# EAGLE schematic ukmarsbot (EAGLE 7.6.0)
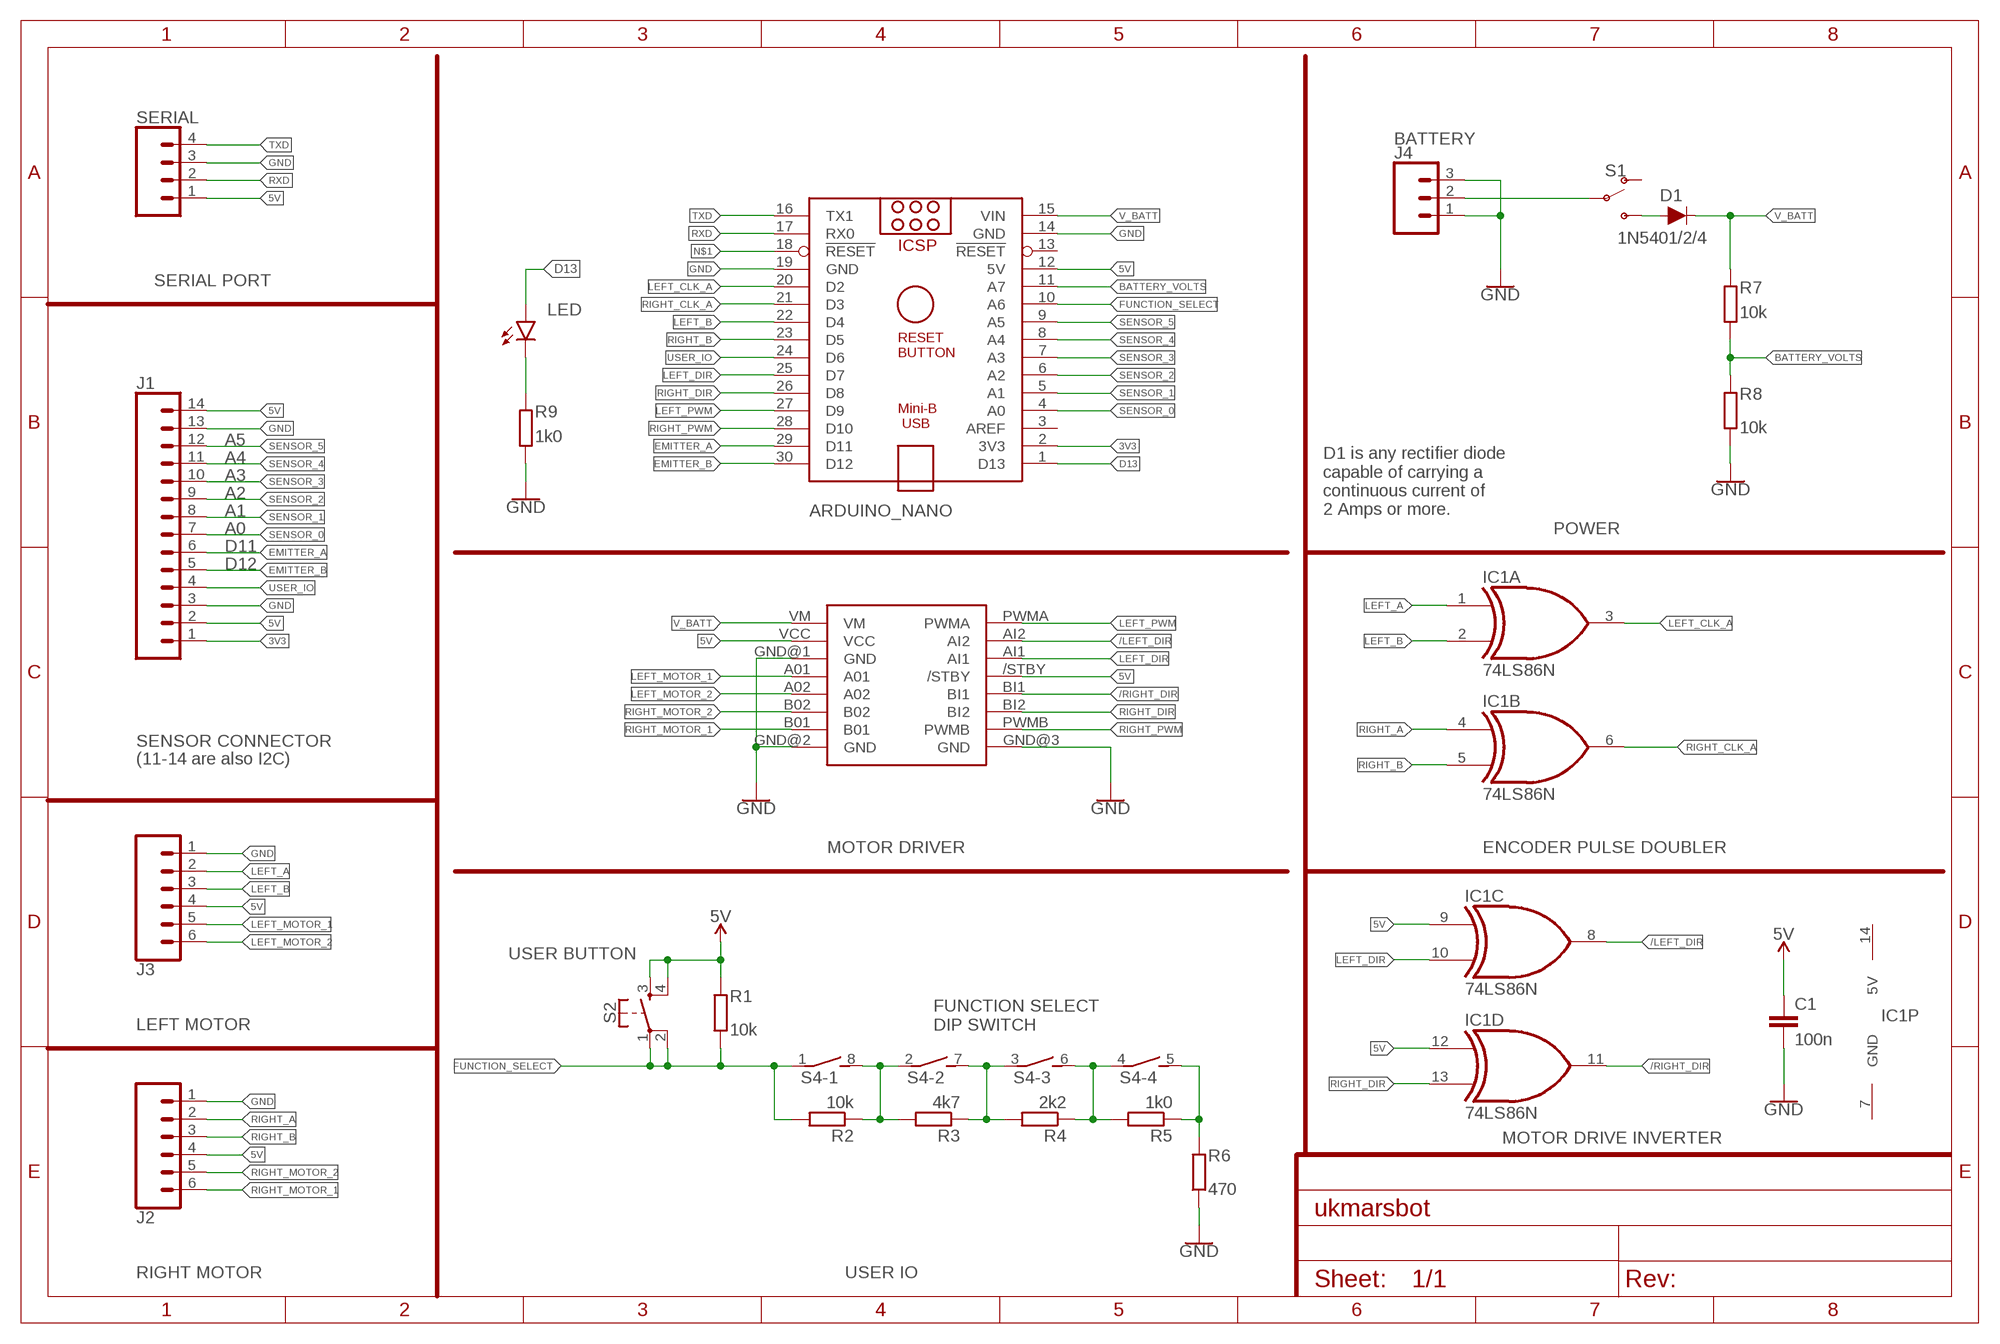
[diagram p0: schematic, sheet 1]
FFEWF (FRAME-A4L): DESIGNER: Peter Harrison; REV: V1.0

## Parts
ARDUINO_NANO  ARDUINO_NANO  [ARDUINO_NANO]
C1  100n  C-EU025-025X050  [C025-025X050]
D1  1N5401/2/4  DIODE-KIT2  [DIODE-1N4001-KIT]
IC1  74LS86N  [DIL14]
J1  CONN_14  [1X14]
J2  CONN_06SILK_FEMALE_PTH  [1X06]
J3  CONN_06SILK_FEMALE_PTH  [1X06]
J4  CONN_03  [1X03]
LED  LED3MM  [LED_3MM]
R1  10k  R-EU_0204/7  [0204/7]
R2  10k  R-EU_0204/7  [0204/7]
R3  4k7  R-EU_0204/7  [0204/7]
R4  2k2  R-EU_0204/7  [0204/7]
R5  1k0  R-EU_0204/7  [0204/7]
R6  470  R-EU_0204/7  [0204/7]
R7  10k  R-EU_0204/7  [0204/7]
R8  10k  R-EU_0204/7  [0204/7]
R9  1k0  R-EU_0204/7  [0204/7]
S1  SWITCH-SPDT-PTH-11.6X4.0MM-KIT  [SWITCH_SPDT_PTH_11.6X4.0MM_KIT]
S2  MOMENTARY-SWITCH-SPST-2  [TACTILE_SWITCH_PTH_6.0MM]
S4  DS04E  [DS-04]
SERIAL  CONN_04PTH  [1X04]
U$1  SPARKFUN-TB6612FNG  [SPARKFUN-TB6612FNG]

## Nets
3V3 [Power]: ARDUINO_NANO.2(3V3) J1.1
5V [Power]: ARDUINO_NANO.12(5V) C1.1 IC1.9(C:I0) IC1.12(D:I0) J1.2 J1.14 J2.4 J3.4 R1.2 S2.3 S2.4 SERIAL.1 U$1./STBY U$1.VCC
/LEFT_DIR: IC1.8(C:O) U$1.AI2
/RIGHT_DIR: IC1.11(D:O) U$1.BI1
BATTERY_VOLTS: ARDUINO_NANO.11(A7) R7.1 R8.2
D13: ARDUINO_NANO.1(D13) LED.A
EMITTER_A: ARDUINO_NANO.29(D11) J1.6
EMITTER_B: ARDUINO_NANO.30(D12) J1.5
FUNCTION_SELECT: ARDUINO_NANO.10(A6) R1.1 R2.2 S2.1 S2.2 S4.1
GND [Power]: ARDUINO_NANO.14(GND) ARDUINO_NANO.19(GND) C1.2 J1.3 J1.13 J2.1 J3.1 J4.1 J4.3 R6.1 R8.1 R9.1 SERIAL.3 U$1.GND@1(GND) U$1.GND@2(GND) U$1.GND@3(GND)
LEFT_A: IC1.1(A:I0) J3.2
LEFT_B: ARDUINO_NANO.22(D4) IC1.2(A:I1) J3.3
LEFT_CLK_A: ARDUINO_NANO.20(D2) IC1.3(A:O)
LEFT_DIR: ARDUINO_NANO.25(D7) IC1.10(C:I1) U$1.AI1
LEFT_MOTOR_1 [Power]: J3.5 U$1.A01
LEFT_MOTOR_2 [Power]: J3.6 U$1.A02
LEFT_PWM: ARDUINO_NANO.27(D9) U$1.PWMA
N$1: ARDUINO_NANO.18(!RESET)
N$5: LED.K(C) R9.2
N$7: R2.1 R3.2 S4.2 S4.8
N$8: R3.1 R4.2 S4.3 S4.7
N$9: R4.1 R5.2 S4.4 S4.6
N$10: R5.1 R6.2 S4.5
N$35 [Power]: J4.2 S1.2(P)
N$36 [Power]: D1.A S1.3(S)
RIGHT_A: IC1.4(B:I0) J2.2
RIGHT_B: ARDUINO_NANO.23(D5) IC1.5(B:I1) J2.3
RIGHT_CLK_A: ARDUINO_NANO.21(D3) IC1.6(B:O)
RIGHT_DIR: ARDUINO_NANO.26(D8) IC1.13(D:I1) U$1.BI2
RIGHT_MOTOR_1 [Power]: J2.6 U$1.B01
RIGHT_MOTOR_2 [Power]: J2.5 U$1.B02
RIGHT_PWM: ARDUINO_NANO.28(D10) U$1.PWMB
RXD: ARDUINO_NANO.17(RX0) SERIAL.2
SENSOR_0: ARDUINO_NANO.4(A0) J1.7
SENSOR_1: ARDUINO_NANO.5(A1) J1.8
SENSOR_2: ARDUINO_NANO.6(A2) J1.9
SENSOR_3: ARDUINO_NANO.7(A3) J1.10
SENSOR_4: ARDUINO_NANO.8(A4) J1.11
SENSOR_5: ARDUINO_NANO.9(A5) J1.12
TXD: ARDUINO_NANO.16(TX1) SERIAL.4
USER_IO: ARDUINO_NANO.24(D6) J1.4
V_BATT [Power]: ARDUINO_NANO.15(VIN) D1.C R7.2 U$1.VM
Unconnected: ARDUINO_NANO.3(AREF) ARDUINO_NANO.13(!RESET) S1.1(O)

## Notes on the sheet
- BATTERY
- SERIAL PORT
- A5
- A4
- A3
- A2
- A1
- A0 | POWER
- D11
- D1 is any rectifier diode
  capable of carrying a 
  continuous current of 
  2 Amps or more.
- D12
- SENSOR CONNECTOR
- (11-14 are also I2C)
- MOTOR DRIVER | ENCODER PULSE DOUBLER
- USER BUTTON
- LEFT MOTOR
- FUNCTION SELECT
  DIP SWITCH
- MOTOR DRIVE INVERTER
- RIGHT MOTOR | USER IO

## Power pins joined to a net without a drawn wire
5V: IC1.14(P:5V)
GND: IC1.7(P:GND)

## Library data of the parts
ARDUINO_NANO = ukmarsbot:ARDUINO_NANO: Arduino Nano V3.0 Overview: The Arduino Nano is a small, complete, and breadboard-friendly board based on the ATmega328 (Arduino Nano 3.x) or ATmega168 (Arduino Nano 2.x). It has more or less the same functionality of the Arduino Duemilanove, but in a different package. It lacks only a DC power jack, and works with a Mini-B USB cable instead of a standard one. The Nano was designed and is being produced by Gravitech. Specifications: Microcontroller Atmel ATmega168 or ATmega328 Operating Voltage (logic level) 5 V Input Voltage (recommended) 7-12 V Input Voltage (limits) 6-20 V Digital I/O Pins 14 (of which 6 provide PWM output) Analog Input Pins 8 DC Current per I/O Pin 40 mA Flash Memory 16 KB (ATmega168) or 32 KB (ATmega328) of which 2 KB used by bootloader SRAM 1 KB (ATmega168) or 2 KB (ATmega328) EEPROM 512 bytes (ATmega168) or 1 KB (ATmega328) Clock Speed 16 MHz Dimensions 0.73" x 1.70" Length 45 mm Width 18 mm Weigth 5 g Power: The Arduino Nano can be powered via the Mini-B USB connection, 6-20V unregulated external power supply (pin 30), or 5V regulated external power supply (pin 27). The power source is automatically selected to the highest voltage source. Memory: The ATmega168 has 16 KB of flash memory for storing code (of which 2 KB is used for the bootloader); the ATmega328 has 32 KB, (also with 2 KB used for the bootloader). The ATmega168 has 1 KB of SRAM and 512 bytes of EEPROM (which can be read and written with the EEPROM library); the ATmega328 has 2 KB of SRAM and 1 KB of EEPROM. Input and Output: Each of the 14 digital pins on the Nano can be used as an input or output, using pinMode(), digitalWrite(), and digitalRead() functions. They operate at 5 volts. Each pin can provide or receive a maximum of 40 mA and has an internal pull-up resistor (disconnected by default) of 20-50 kOhms. In addition, some pins have specialized functions. Visit Arduino - ArduinoBoardNano <https://www.arduino.cc/en/Main/ArduinoBoardNano>
C1 = ukmarsbot:C-EU: CAPACITOR, European symbol
D1 = ukmarsbot:DIODE: Diode These are standard reverse protection diodes and small signal diodes. SparkFun Products: SparkFun SparkPunk Sound Kit <https://www.sparkfun.com/products/11177> SparkFun ESP8266 Thing <https://www.sparkfun.com/products/13231>; PROD_ID: DIO-09176; VALUE: 1A/50V/1.1V
IC1 = ukmarsbot:74*86: Quad 2-input EXCLUSIV-OR (XOR) gate
J1 = ukmarsbot:CONN_14: Multi connection point. Often used as Generic Header-pin footprint for 0.1 inch spaced/style header connections On any of the 0.1 inch spaced packages, you can populate with these: Break Away Headers - Straight <https://www.sparkfun.com/products/116> (PRT-00116) Break Away Male Headers - Right Angle <https://www.sparkfun.com/products/553> (PRT-00553) Female Headers <https://www.sparkfun.com/products/115> (PRT-00115) Break Away Headers - Machine Pin <https://www.sparkfun.com/products/117> (PRT-00117) Break Away Female Headers - Swiss Machine Pin <https://www.sparkfun.com/products/743> (PRT-00743) For SCREWTERMINALS and SPRING TERMINALS visit here: Screw Terimnals on SparkFun.com <https://www.sparkfun.com/search/results?term=Screw+Terminals> (5mm/3.5mm/2.54mm spacing) This device is also useful as a general connection point to wire up your design to another part of your project. Our various solder wires solder well into these plated through hole pads. Hook-Up Wire - Assortment (Stranded, 22 AWG) <https://www.sparkfun.com/products/11375> (PRT-11375) Hook-Up Wire - Assortment (Solid Core, 22 AWG) <https://www.sparkfun.com/products/11367> (PRT-11367) View the entire wire category on our website here <https://www.sparkfun.com/categories/141> Special notes: Molex polarized connector foot print use with SKU : PRT-08231 with associated crimp pins and housings. 1MM SMD Version SKU: PRT-10208 NOTES ON THE VARIANTS LOCK and LOCK_LONGPADS... This footprint was designed to help hold the alignment of a through-hole component (i.e. 6-pin header) while soldering it into place. You may notice that each hole has been shifted either up or down by 0.005 of an inch from it's more standard position (which is a perfectly straight line). This slight alteration caused the pins (the squares in the middle) to touch the edges of the holes. Because they are alternating, it causes a "brace" to hold the component in place. 0.005 has proven to be the perfect amount of "off-center" position when using our standard breakaway headers. Although looks a little odd when you look at the bare footprint, once you have a header in there, the alteration is very hard to notice. Also,if you push a header all the way into place, it is covered up entirely on the bottom side.
J2 J3 = ukmarsbot:CONN_06: Multi connection point. Often used as Generic Header-pin footprint for 0.1 inch spaced/style header connections On any of the 0.1 inch spaced packages, you can populate with these: Break Away Headers - Straight <https://www.sparkfun.com/products/116> (PRT-00116) Break Away Male Headers - Right Angle <https://www.sparkfun.com/products/553> (PRT-00553) Female Headers <https://www.sparkfun.com/products/115> (PRT-00115) Break Away Headers - Machine Pin <https://www.sparkfun.com/products/117> (PRT-00117) Break Away Female Headers - Swiss Machine Pin <https://www.sparkfun.com/products/743> (PRT-00743) Arduino Stackable Header - 6 Pin <https://www.sparkfun.com/products/9280> (PRT-09280) For SCREWTERMINALS and SPRING TERMINALS visit here: Screw Terimnals on SparkFun.com <https://www.sparkfun.com/search/results?term=Screw+Terminals> (5mm/3.5mm/2.54mm spacing) This device is also useful as a general connection point to wire up your design to another part of your project. Our various solder wires solder well into these plated through hole pads. Hook-Up Wire - Assortment (Stranded, 22 AWG) <https://www.sparkfun.com/products/11375> (PRT-11375) Hook-Up Wire - Assortment (Solid Core, 22 AWG) <https://www.sparkfun.com/products/11367> (PRT-11367) View the entire wire category on our website here <https://www.sparkfun.com/categories/141>; PROD_ID: CONN-08437
J4 = ukmarsbot:CONN_03: Multi connection point. Often used as Generic Header-pin footprint for 0.1 inch spaced/style header connections On any of the 0.1 inch spaced packages, you can populate with these: Break Away Headers - Straight <https://www.sparkfun.com/products/116> (PRT-00116) Break Away Male Headers - Right Angle <https://www.sparkfun.com/products/553> (PRT-00553) Female Headers <https://www.sparkfun.com/products/115> (PRT-00115) Break Away Headers - Machine Pin <https://www.sparkfun.com/products/117> (PRT-00117) Break Away Female Headers - Swiss Machine Pin <https://www.sparkfun.com/products/743> (PRT-00743) Stackable Header - 3 Pin (Female, 0.1") <https://www.sparkfun.com/products/13875> (PRT-13875) For SCREWTERMINALS and SPRING TERMINALS visit here: Screw Terimnals on SparkFun.com <https://www.sparkfun.com/search/results?term=Screw+Terminals> (5mm/3.5mm/2.54mm spacing) This device is also useful as a general connection point to wire up your design to another part of your project. Our various solder wires solder well into these plated through hole pads. Hook-Up Wire - Assortment (Stranded, 22 AWG) <https://www.sparkfun.com/products/11375> (PRT-11375) Hook-Up Wire - Assortment (Solid Core, 22 AWG) <https://www.sparkfun.com/products/11367> (PRT-11367) View the entire wire category on our website here <https://www.sparkfun.com/categories/141> Special notes: Molex polarized connector foot print use with SKU : PRT-08232 with associated crimp pins and housings.; PROD_ID: XXX-00000; VALUE: 455-1750-1-ND
LED = ukmarsbot:LED: LED (Generic) Standard schematic elements and footprints for 5mm, 3mm, 1206, and 0603 sized LEDs. Generic LEDs with no color specified.; PROD_ID: DIO-08794
R1-R9 = ukmarsbot:R-EU_: RESISTOR, European symbol
S1 = ukmarsbot:SWITCH-SPDT: Single Pole, Double Throw (SPDT) Switch Single-pole, double-throw (SPDT) switch. Variant Overview SMD-AYZ0202 Surface Mount DPDT Switch <https://www.sparkfun.com/products/597> (COM-00597) Used on e.g. LilyPad Arduino USB - ATmega32U4 Board <https://www.sparkfun.com/products/12049> PTH-11.6X4.0MM SPDT Mini Power Switch <https://www.sparkfun.com/products/102> (COM-00102) Used on e.g. SparkFun Simon Says - Through-Hole Soldering Kit <https://www.sparkfun.com/products/10547> (KIT-10547) PTH-11.6X4.0MM-KIT KIT version of SPDT Mini Power Switch - Simplifies soldering by removing tStop of switch pins - only one side can be soldered. PTH-11.6X4.0MM-LOCK LOCK version of SPDT Mini Power Switch - Offset pins hold switch in place for easier soldering. SMD-RIGHT-ANGLE Surface Mount Right Angle Switch <https://www.sparkfun.com/products/10860> (COM-10860) Used on e.g. SparkFun ESP8266 Thing <https://www.sparkfun.com/products/13231>; PROD_ID: SWCH-08261; SF_SKU: COM-00102
S2 = ukmarsbot:MOMENTARY-SWITCH-SPST-2: Momentary Switch (Pushbutton) - SPST - Two Circuits Normally-open (NO) SPST momentary switches (buttons, pushbuttons). Schematic symbol includes two switch circuits. Variants SMD-4.6MMX2.8MM - 4.60mm x 2.80mm Tactile Momentary Button Switch - Used on SparkFun SAMD21 Mini Breakout <https://www.sparkfun.com/products/13664> SMD-5.2MM - Mini Pushbutton Switch - SMD <https://www.sparkfun.com/products/8720> - Used on Arduino Pro Mini <https://www.sparkfun.com/products/11114>
S4 = ukmarsbot:DS04E: DIL/CODE SWITCH; OC_FARNELL: unknown; OC_NEWARK: unknown
SERIAL = ukmarsbot:CONN_04: Multi connection point. Often used as Generic Header-pin footprint for 0.1 inch spaced/style header connections On any of the 0.1 inch spaced packages, you can populate with these: Break Away Headers - Straight <https://www.sparkfun.com/products/116> (PRT-00116) Break Away Male Headers - Right Angle <https://www.sparkfun.com/products/553> (PRT-00553) Female Headers <https://www.sparkfun.com/products/115> (PRT-00115) Break Away Headers - Machine Pin <https://www.sparkfun.com/products/117> (PRT-00117) Break Away Female Headers - Swiss Machine Pin <https://www.sparkfun.com/products/743> (PRT-00743) For SCREWTERMINALS and SPRING TERMINALS visit here: Screw Terimnals on SparkFun.com <https://www.sparkfun.com/search/results?term=Screw+Terminals> (5mm/3.5mm/2.54mm spacing) This device is also useful as a general connection point to wire up your design to another part of your project. Our various solder wires solder well into these plated through hole pads. Hook-Up Wire - Assortment (Stranded, 22 AWG) <https://www.sparkfun.com/products/11375> (PRT-11375) Hook-Up Wire - Assortment (Solid Core, 22 AWG) <https://www.sparkfun.com/products/11367> (PRT-11367) View the entire wire category on our website here <https://www.sparkfun.com/categories/141> Special notes: Molex polarized connector foot print use with SKU : PRT-08231 with associated crimp pins and housings. 1MM SMD Version SKU: PRT-10208; PROD_ID: CONN-09696
U$1 = ukmarsbot:SPARKFUN-TB6612FNG

## Net classes
0 default: width 0.406 mm, clearance 0.205 mm
1 Power: width 1.27 mm, clearance 0.2 mm